# EAGLE design MT Relay switch (EAGLE 9.2.2)
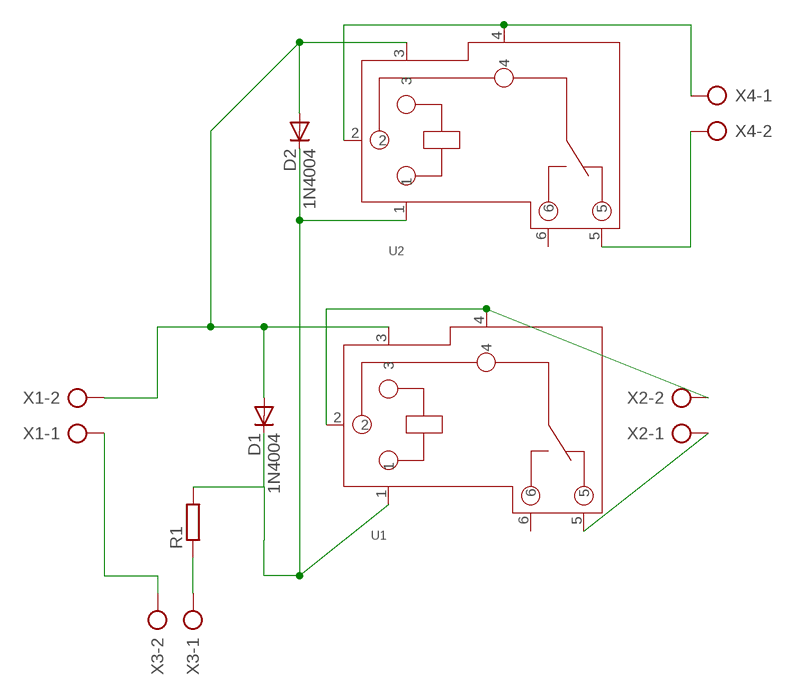
[diagram p0: schematic, sheet 1]

## Parts
D1  1N4004  [DO41-10]
D2  1N4004  [DO41-10]
R1  R-EU_0204/7  [0204/7]
U1  RELAY-SLA-05VDC-SL-C  [6P-19.8H]
U2  RELAY-SLA-05VDC-SL-C  [6P-19.8H]
X1  AK300/2  [AK300/2]
X2  AK300/2  [AK300/2]
X3  AK300/2  [AK300/2]
X4  AK300/2  [AK300/2]

## Nets
N$1: U1.5 X2.1
N$2: D1.A D2.A U1.3 U2.3 X1.2
N$3: U1.2 U1.4 X2.2
N$4: X1.1 X3.2
N$5: R1.1 X3.1
N$6: D1.C D2.C R1.2 U1.1 U2.1
N$8: U2.2 U2.4 X4.1
N$9: U2.5 X4.2
Unconnected: U1.6 U2.6

## Library data of the parts
D1 D2 = diode-1:1N4004: DIODE general purpose rectifier, 1 A
R1 = Relay(30A)_sla_12v_slc_v1.0:R-EU_: RESISTOR, European symbol; SPICEPREFIX: R
U1 U2 = Relay(30A)_sla_12v_slc_v1.0:RELAY-SLA-05VDC-SL-C: · Up to 30A switching in SPST and 20A switching in spot arrangements. · Available as an open-frame relay, with a snap-on dust cover or with an immersion cleanable, plastic sealed case.
X1-X4 = con-ptr500:AK300/2: CONNECTOR

## Board
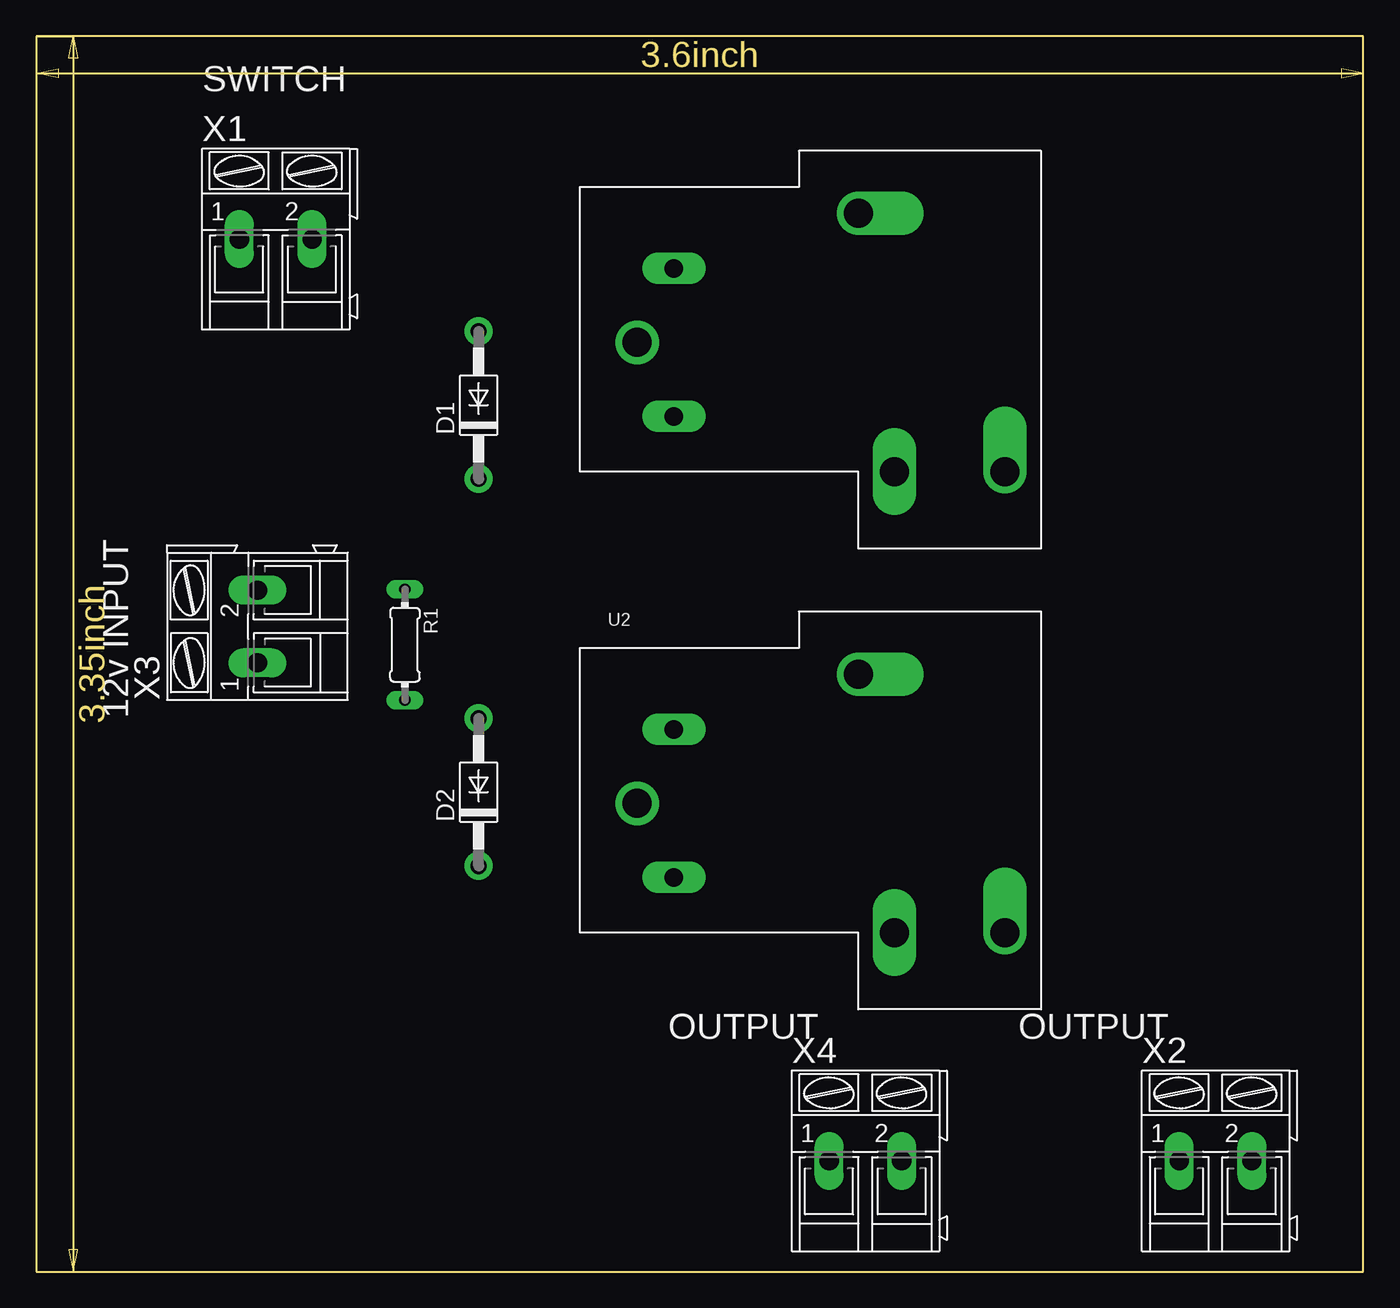
[diagram p1: board, top side]
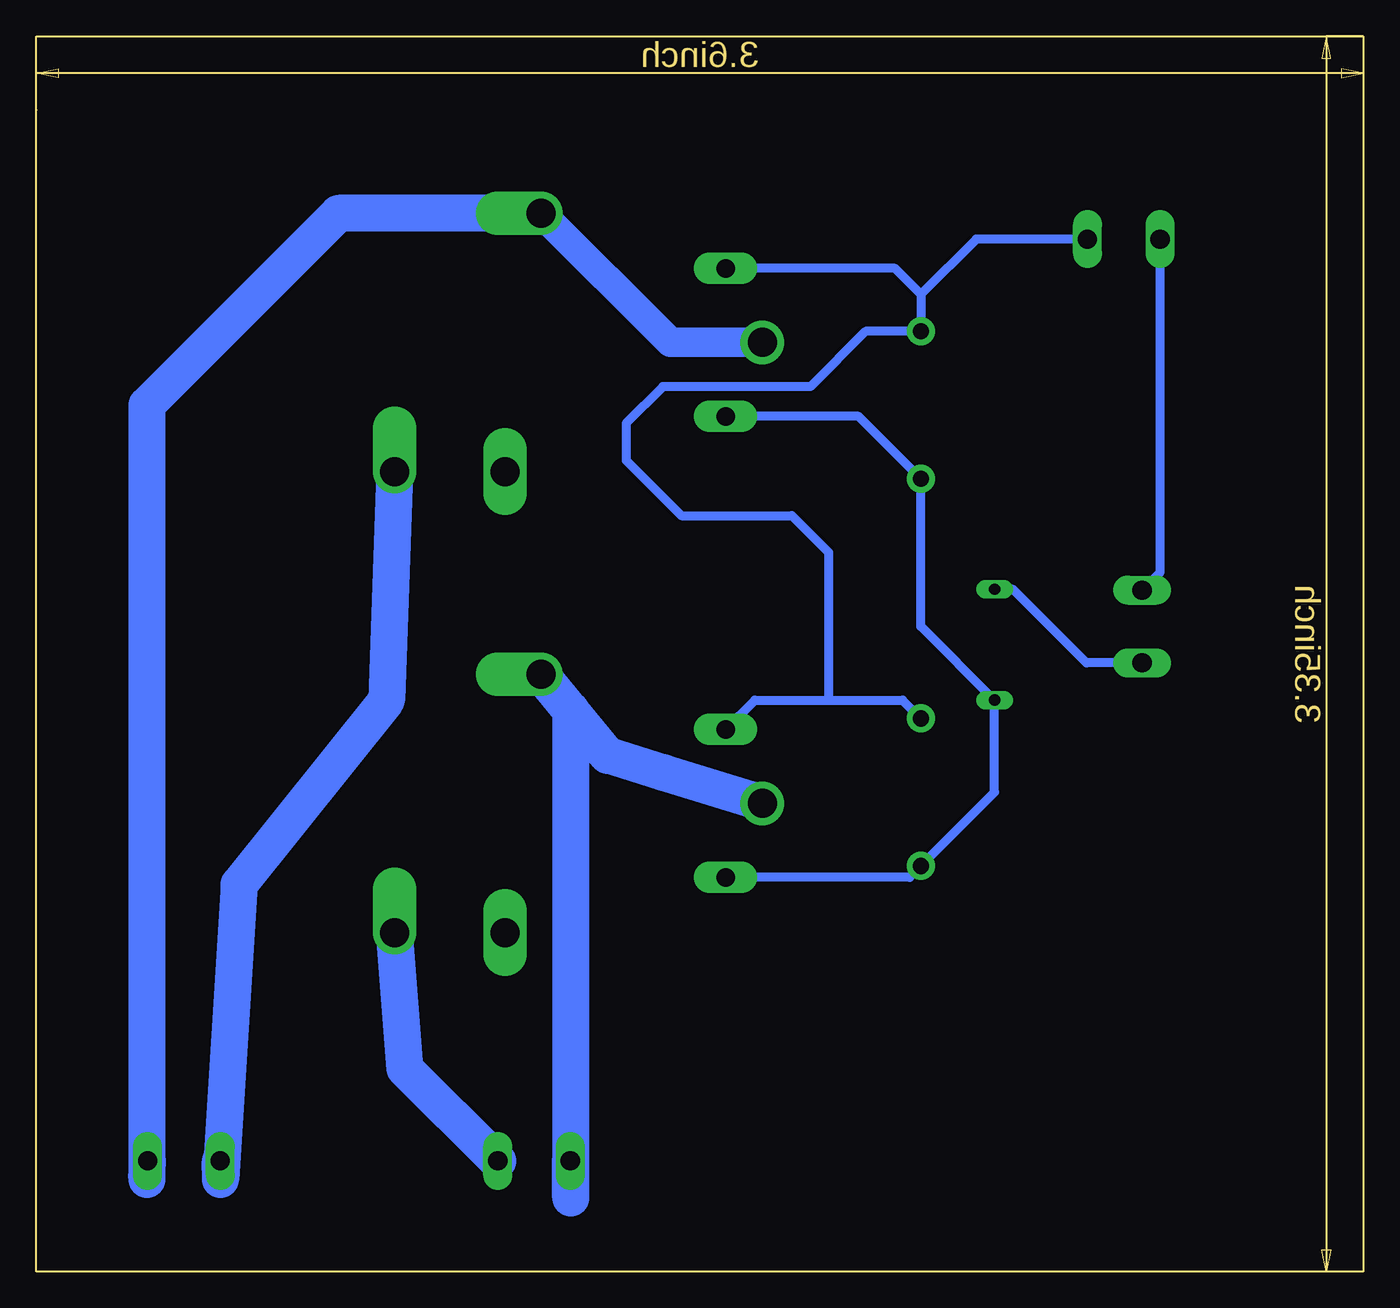
[diagram p2: board, bottom side, seen from below]

Size 91.44 x 85.09 mm. Coordinates in mm from the lower left corner, seen from the top.
Outline: 0,85.09 0,0 91.44,0 91.44,85.09 0,85.09
Copper layers (1*16): Top 0.035mm / dielectric 1.5mm / Bottom 0.035mm
Design rules "default": minimum track width 6mil, minimum drill 0.35mm, track to track 6mil, track to pad 6mil, pad to pad 6mil, via to via 6mil, smd to smd 6mil, copper to edge 40mil, drill to drill 6mil, minimum pad ring 10mil, minimum via ring 8mil, stop-mask expansion 4mil, vias tented up to drill 0mil, thermal gap 10mil

### Footprints (pad centres in the part's own frame; a part is rotated, then mirrored left to right if it is on the bottom)
DO41-10 = drill 1.118 pad 1.93: A 5.08,0; C -5.08,0
0204/7 = drill 0.762 long: 1 -3.81,0; 2 3.81,0
6P-19.8H = drill 1.27 pad 2.184 long: 1 -9.4,-4.6; 3 -9.4,5.6 | drill 2 pad 3: 2 -11.94,0.5 | drill 2 pad 3 offset: 4 3.3,9.4; 5 13.4,-8.4 | drill 2 pad 3 long: 6 5.8,-8.4
AK300/2 = drill 1.321 long: 1 -2.515,0; 2 2.489,0

### Placement (x,y rotation side)
D1  30.48,59.69 90 top
D2  30.48,33.02 90 top
R1  25.4,43.18 270 top
U1  53.34,63.5 0 top
U2  53.34,31.75 0 top
X1  16.51,71.12 0 top
X2  81.28,7.62 0 top
X3  15.24,44.45 90 top
X4  57.15,7.62 0 top

### Tracks (layer width: path | path; a pad name or v marks a point on that pad's centre or on a via)
N$1
  Bottom 2.54: U1.5 67.31,39.37 77.47,26.67 78.74,6.35 X2.1
N$2
  Bottom 0.61: 30.48,67.31 D1.A 34.29,64.77 38.1,60.96 48.26,60.96 50.8,58.42 50.8,55.88 46.99,52.07 39.37,52.07 36.83,49.53 36.83,39.37 | 30.48,67.31 32.27,69.1 U1.3 | 36.83,39.37 41.92,39.37 U2.3 | 36.83,39.37 31.75,39.37 D2.A | X1.2 26.67,71.12 30.48,67.31
N$3
  Bottom 2.032: U1.2 47.74,64 U1.4
  Bottom 2.54: X2.2 83.82,6.35 83.82,59.69 70.61,72.9 U1.4
N$4
  Bottom 0.61: X3.2 14,48.18 X1.1
N$5
  Bottom 0.61: X3.1 19.07,41.93 24.13,46.99 R1.1
N$6
  Bottom 0.61: U1.1 34.77,58.9 D1.C 30.48,44.45 R1.2 25.4,33.02 D2.C 31.27,27.15 U2.1
N$8
  Bottom 2.54: U2.2 48.23,34.37 52.07,35.56 54.61,38.67 | 54.61,38.67 U2.4 | 54.61,38.67 54.61,5.08 X4.1
N$9
  Bottom 2.54: X4.2 66.04,13.97 U2.5

### Text on the board
tNames: SWITCH | 12v INPUT | OUTPUT | OUTPUT